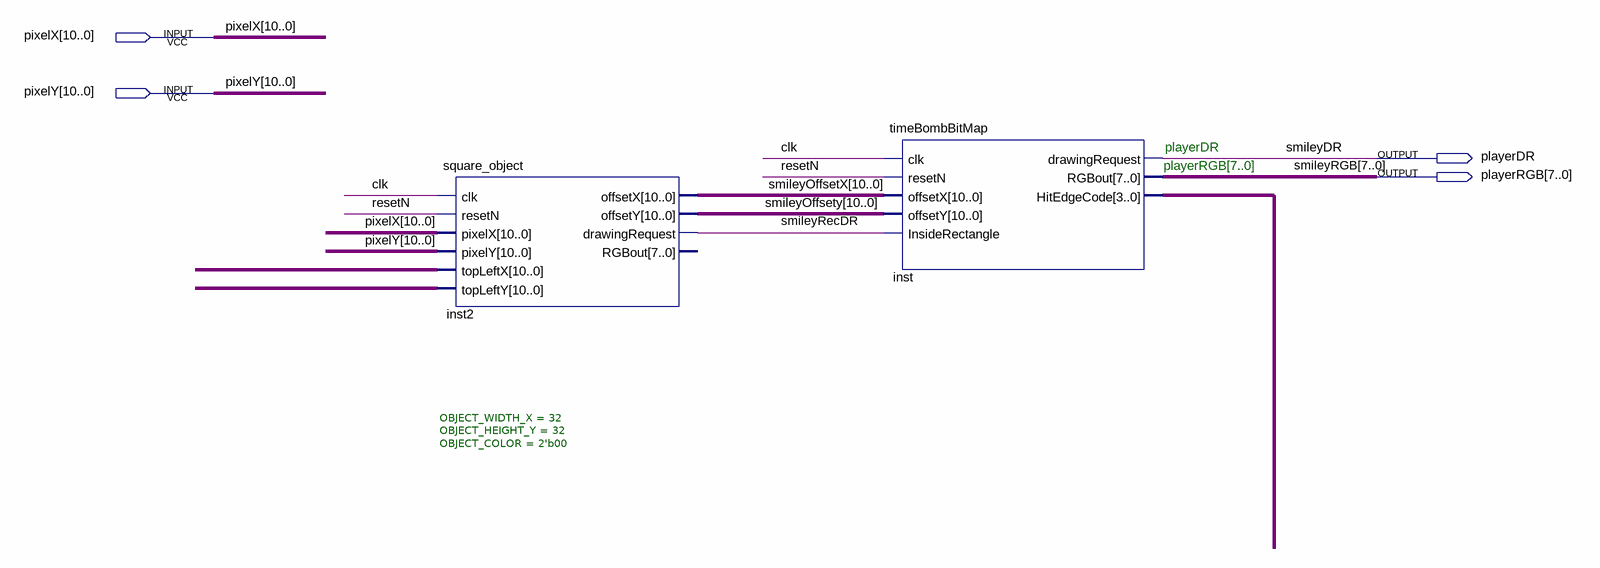
[diagram p0: schematic sheet]
// Quartus schematic timeBombTOP.bdf as structural Verilog: 2 symbols, 4 pins
module timeBombTOP (
  input  [10:0] pixelX,
  input  [10:0] pixelY,
  output playerDR,
  output [7:0] playerRGB
);

  wire clk, resetN, smileyRecDR;
  wire [3:0] inst_hitedgecode;
  wire [10:0] smileyOffsetX, smileyOffsety, undriven, undriven_2;

  square_object #(.OBJECT_WIDTH_X(32), .OBJECT_HEIGHT_Y(32), .OBJECT_COLOR(2'b00)) inst2 (
    .clk(clk), .resetN(resetN), .pixelX(pixelX), .pixelY(pixelY), .topLeftX(undriven_2), .topLeftY(undriven),
    .offsetX(smileyOffsetX), .offsetY(smileyOffsety), .drawingRequest(smileyRecDR));  // open: RGBout
  timeBombBitMap inst (
    .clk(clk), .resetN(resetN), .offsetX(smileyOffsetX), .offsetY(smileyOffsety),
    .InsideRectangle(smileyRecDR), .drawingRequest(playerDR), .RGBout(playerRGB),
    .HitEdgeCode(inst_hitedgecode));

  // Other names for the same wires on the sheet: smileyDR = playerDR; smileyRGB[7:0] = playerRGB

  // Notes on the sheet:
  //   playerDR
  //   playerRGB[7..0]
endmodule
